# EAGLE design LiquidCrystal595 (EAGLE 7.4.0)
LiquidCrystal595 Connect 16x2 LCD to Arduino with only 3 pins Author: Haipham Date created: 20/09/2015
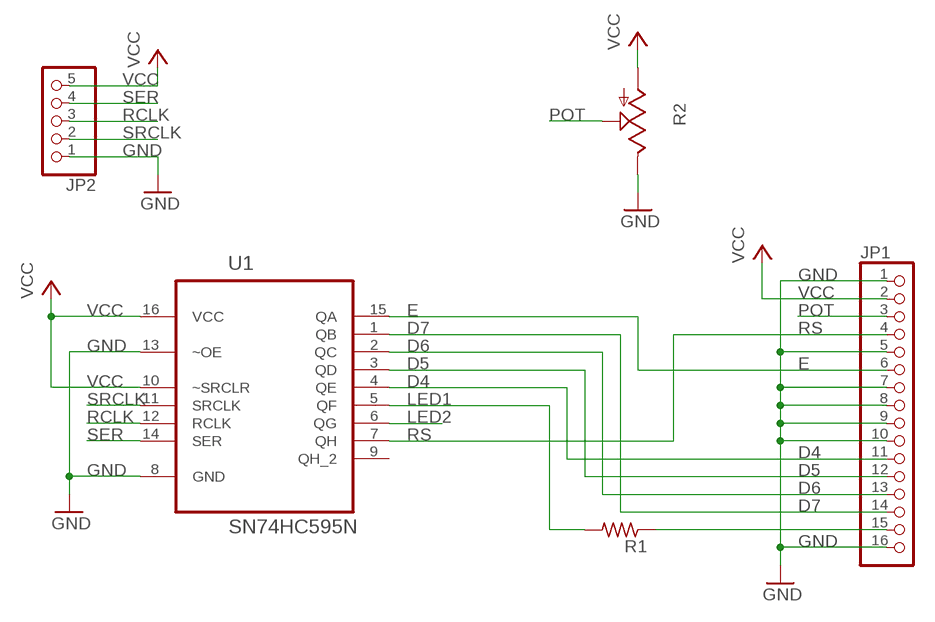
[diagram p0: schematic, sheet 1]

## Parts
JP1  PINHD-1X16  [1X16]
JP2  PINHD-1X5  [1X05]
R1  R-US_0204/7  [0204/7]
R2  TRIM_US-B25P  [B25P]
U1  SN74HC595N  [DIP254P762X508-16]

## Nets
D4: JP1.11 U1.4(QE)
D5: JP1.12 U1.3(QD)
D6: JP1.13 U1.2(QC)
D7: JP1.14 U1.1(QB)
E: JP1.6 U1.15(QA)
GND: JP1.1 JP1.5 JP1.7 JP1.8 JP1.9 JP1.10 JP1.16 JP2.1 R2.E U1.8(GND) U1.13(~OE)
LED1: R1.2 U1.5(QF)
LED2: U1.6(QG)
N$7: JP1.15 R1.1
POT: JP1.3 R2.S
RCLK: JP2.3 U1.12(RCLK)
RS: JP1.4 U1.7(QH)
SER: JP2.4 U1.14(SER)
SRCLK: JP2.2 U1.11(SRCLK)
VCC: JP1.2 JP2.5 R2.A U1.10(~SRCLR) U1.16(VCC)
Unconnected: U1.9(QH_2)

## Library data of the parts
JP1 = pinhead:PINHD-1X16: PIN HEADER
JP2 = pinhead:PINHD-1X5: PIN HEADER
R1 = resistor:R-US_: RESISTOR, American symbol
R2 = pot:TRIM_US-: POTENTIOMETER
U1 = Texas Instruments_By_element14_Batch_1:SN74HC595N: 8-BIT SHIFT REGISTERS WITH 3-STATE OUTPUT REGISTERS; MPN: SN74HC595N; OC_FARNELL: 9591664; OC_NEWARK: 60K6845; PACKAGE: PDIP-16; SUPPLIER: Texas Instruments

## Net classes
0 default: width 0.508 mm

## Board
LiquidCrystal595 Connect 16x2 LCD to Arduino with only 3 pins Author: Haipham Date created: 20/09/2015
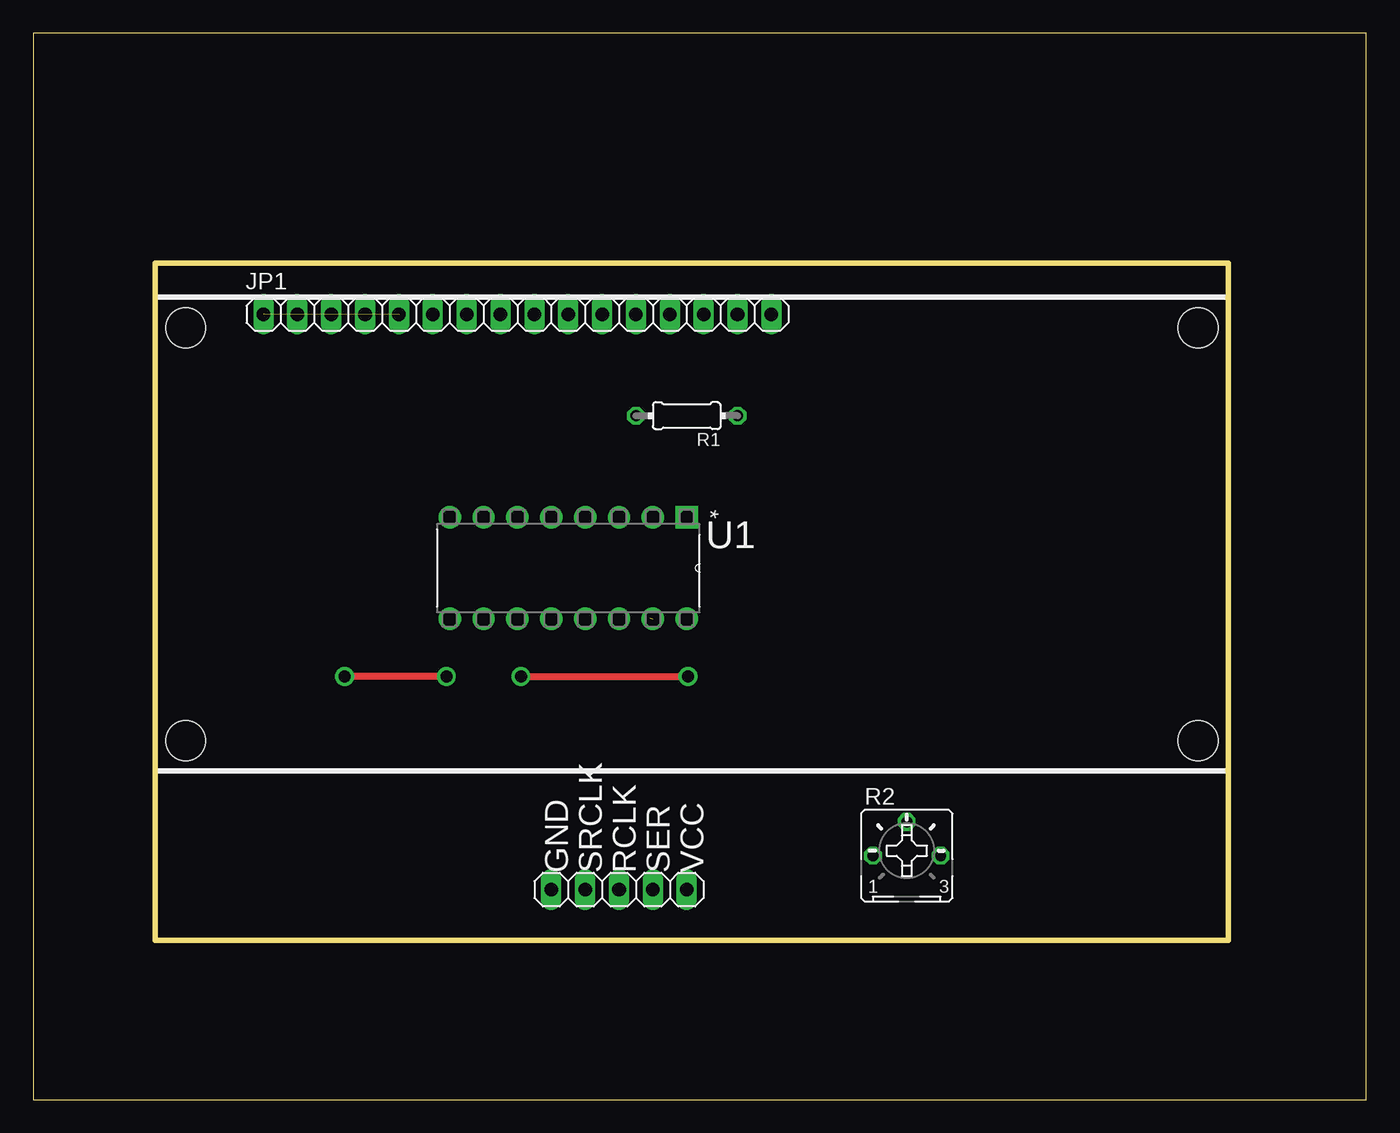
[diagram p1: board, top side]
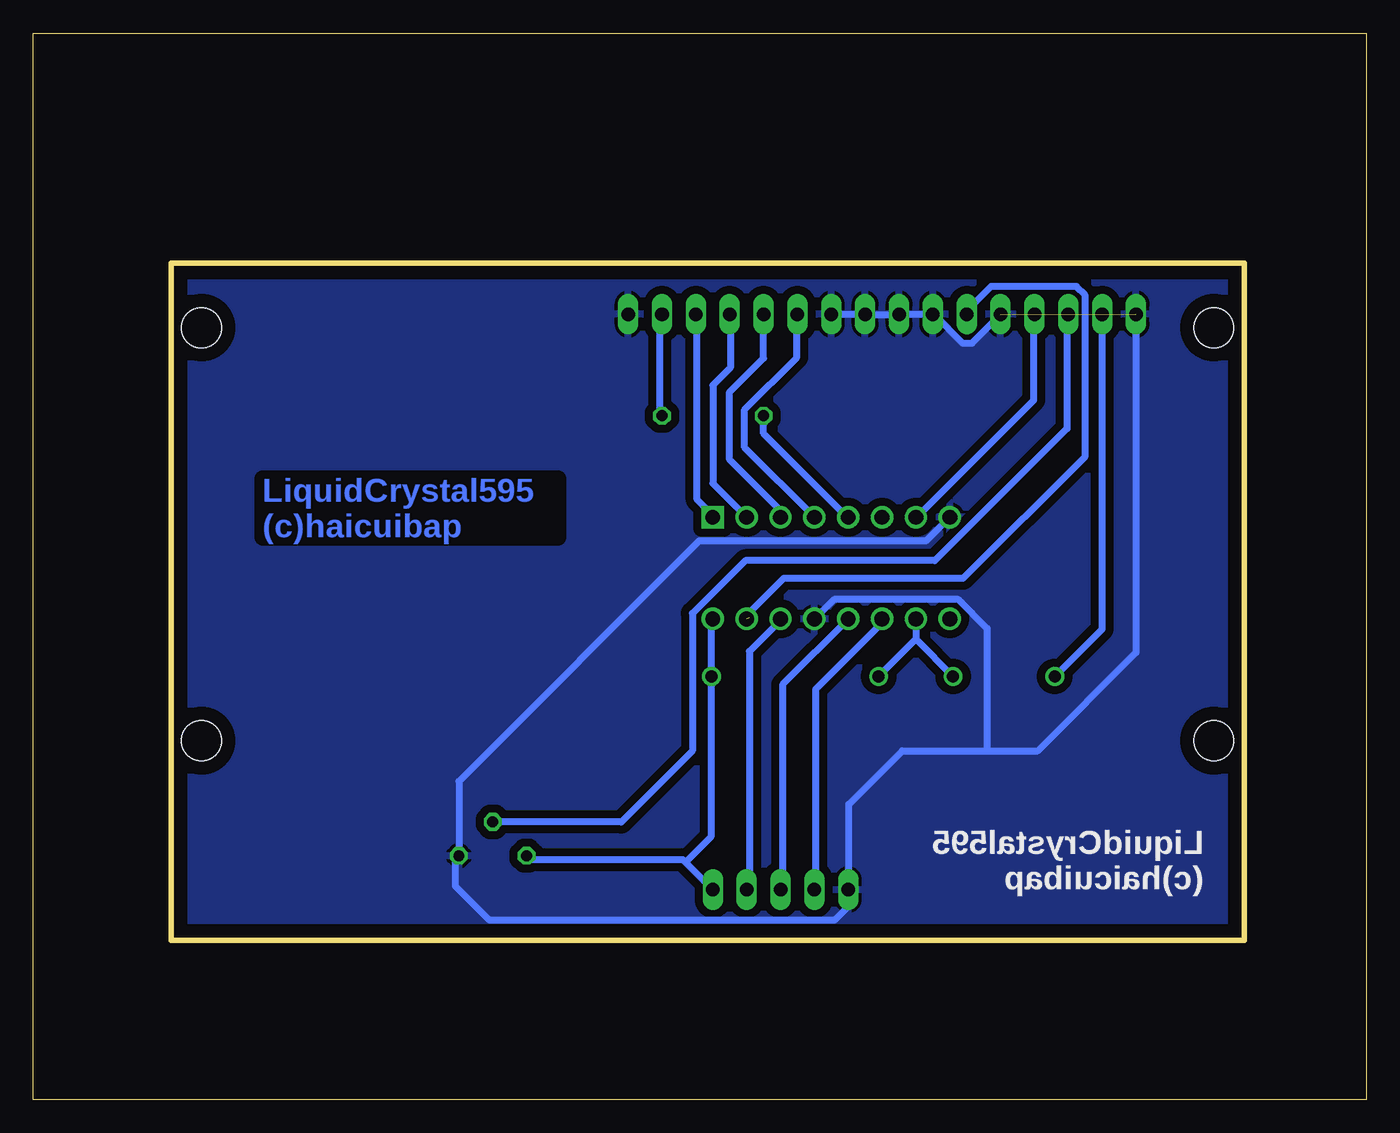
[diagram p2: board, bottom side, seen from below]

Size 100 x 80 mm. Coordinates in mm from the lower left corner, seen from the top.
Outline: 0,0 100,0 100,80 0,80 0,0
Outline: 9.14,62.74 89.66,62.74 89.66,11.94 9.14,11.94 9.14,62.74
Copper layers (1*16): Top 0.035mm / dielectric 1.5mm / Bottom 0.035mm
Design rules "default": minimum track width 10mil, minimum drill 24mil, track to track 8mil, track to pad 8mil, pad to pad 8mil, via to via 8mil, smd to smd 8mil, copper to edge 40mil, drill to drill 8mil, minimum pad ring 10mil, minimum via ring 8mil, stop-mask expansion 4mil, vias tented up to drill 0mil, thermal gap 10mil
Holes 3 mm at 87.38,57.91 87.38,26.92 11.43,57.91 11.43,26.92

### Footprints (pad centres in the part's own frame; a part is rotated, then mirrored left to right if it is on the bottom)
1X16 = drill 1.016 long: 1 -19.05,0; 2 -16.51,0; 3 -13.97,0; 4 -11.43,0; 5 -8.89,0; 6 -6.35,0; 7 -3.81,0; 8 -1.27,0; 9 1.27,0; 10 3.81,0; 11 6.35,0; 12 8.89,0; 13 11.43,0; 14 13.97,0; 15 16.51,0; 16 19.05,0
1X05 = drill 1.016 long: 1 -5.08,0; 2 -2.54,0; 3 0,0; 4 2.54,0; 5 5.08,0
0204/7 = drill 0.813 octagon: 1 -3.81,0; 2 3.81,0
B25P = drill 0.813 octagon: A -2.54,0; E 2.54,0; S 0,2.54
DIP254P762X508-16 = drill 1.118 square: 1 -7.62,17.78 | drill 1.118: 2 -7.62,15.24; 3 -7.62,12.7; 4 -7.62,10.16; 5 -7.62,7.62; 6 -7.62,5.08; 7 -7.62,2.54; 8 -7.62,0; 9 0,0; 10 0,2.54; 11 0,5.08; 12 0,7.62; 13 0,10.16; 14 0,12.7; 15 0,15.24; 16 0,17.78

### Placement (x,y rotation side)
JP1  36.32,58.93 0 top
JP2  43.94,15.75 0 top
R1  49.02,51.31 180 top
R2  65.53,18.29 0 top
U1  31.24,36.07 270 top

### Tracks (layer width: path | path; a pad name or v marks a point on that pad's centre or on a via)
D4
  Bottom 0.508: U1.4 46.63,48.92 46.63,51.77 42.72,55.68 42.72,58.88 JP1.11
D5
  Bottom 0.508: U1.3 43.94,44.2 47.75,48.01 47.75,53.09 45.21,55.63 JP1.12
D6
  Bottom 0.508: JP1.13 47.7,58.88 47.7,54.91 49.02,53.59 49.02,46.23 U1.2
D7
  Bottom 0.508: JP1.14 50.19,58.88 50.19,45.01 49.12,43.94 U1.1
E  (1 unrouted)
  Bottom 0.508: JP1.6 29.92,59.23 28.14,61.01 21.74,61.01 21.08,60.35 21.08,48.26 30.23,39.12 43.69,39.12 46.28,36.52 46.28,36.12
GND  (1 unrouted)
  Bottom 0.508: U1.13 41.3,36.12 39.88,37.54 30.63,37.54 28.45,35.36 28.45,26.16 | JP1.10 39.88,58.88 37.74,58.88 JP1.9 37.39,58.88 35.26,58.88 JP1.8 34.9,58.88 32.77,58.88 JP1.7 32.41,58.88 30.28,56.74 29.57,56.74 27.43,58.88 JP1.5 | JP1.1 17.27,33.53 24.64,26.16 28.45,26.16 | 28.45,26.16 34.8,26.16 38.81,22.15 38.81,15.85 JP2.1 38.86,14.48 39.88,13.46 65.79,13.46 68.33,16 68.33,18.03 R2.E 68.07,23.88 50.04,41.91 33.02,41.91 U1.8
  pour Bottom (isolate 0.61): 9.14,62.74 89.66,62.74 89.66,11.94 9.14,11.94
LED1
  Bottom 0.508: R1.2 45.21,49.99 39.17,43.94 U1.5
N$7
  Bottom 0.508: R1.1 53.03,51.41 53.03,58.88 JP1.15
POT
  Bottom 0.508: R2.S 55.88,20.83 50.55,26.16 50.55,36.47 46.58,40.44 32.36,40.44 22.45,50.34 22.45,58.88 JP1.3
RCLK
  Bottom 0.508: U1.12 43.79,31.14 43.79,15.85 JP2.3
RS
  Bottom 0.508: JP1.4 24.94,58.88 24.94,52.48 33.48,43.94 U1.7
SER
  Bottom 0.508: JP2.4 46.28,15.85 46.28,33.63 44.15,35.76 U1.14
SRCLK
  Bottom 0.508: JP2.2 41.3,15.85 41.3,30.79 36.32,35.76 U1.11
VCC  (via drill 0.9 pad 1.42)
  Top 0.508: v36.58,31.75 v49.12,31.75 | v30.99,31.75 v23.37,31.75
  Bottom 0.508: JP2.5 51.08,17.8 | 51.08,17.8 51.26,17.98 62.99,17.98 R2.A | 51.08,17.8 49.12,19.76 v49.12,31.75 49.12,35.76 U1.16 | 33.78,34.54 v36.58,31.75 | JP1.2 19.81,35.31 v23.37,31.75 | U1.10 33.78,34.54 | 33.78,34.54 v30.99,31.75

### Text on the board
Bottom: LiquidCrystal595 / (c)haicuibap
tNames: GND | SRCLK | RCLK | SER | VCC
bNames: LiquidCrystal595 / (c)haicuibap